# Altium schematic sheet HDMI_DP.SchDoc
size A4; SheetNumber: 7; SheetTotal: 10
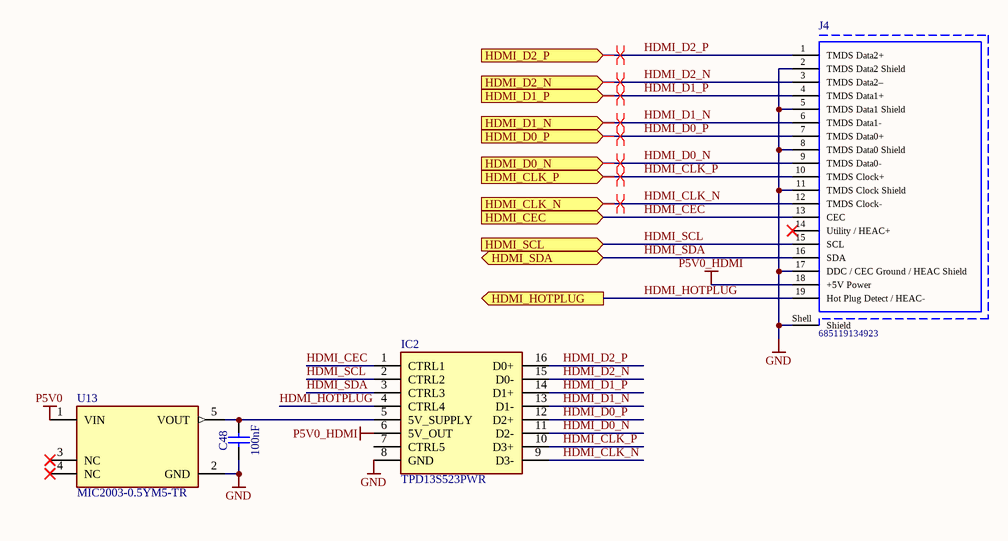
[diagram p0: HDMI_DP.SchDoc]

## Parts
C48  100nF  [CAPC1005X55N]
IC2  TPD13S523PWR  [SOP65P640X120-16N]
J4  685119134923  [685119134923]
U13  MIC2003-0.5YM5-TR  [FP-SOT23-5LD-PL-1-IPC_A]

## Ports
HDMI_CEC (in), HDMI_CLK_N (in), HDMI_CLK_P (in), HDMI_D0_N (in), HDMI_D0_P (in), HDMI_D1_N (in), HDMI_D1_P (in), HDMI_D2_N (in), HDMI_D2_P (in), HDMI_HOTPLUG (out), HDMI_SCL (in), HDMI_SDA (bidir)

## Nets
GND: C48.1 IC2.8(GND) J4.2(TMDS_Data2_Shield) J4.5(TMDS_Data1_Shield) J4.8(TMDS_Data0_Shield) J4.11(TMDS_Clock_Shield) J4.17(DDC_/_CEC_Ground_/_HEAC_Shield) J4.Shell(Shield) U13.2(GND)
P5V0: U13.1(VIN)
P5V0_HDMI: IC2.6(5V_OUT) J4.18(+5V_Power)
HDMI_CEC: IC2.1(CTRL1) J4.13(CEC) ; port HDMI_CEC
HDMI_CLK_N: IC2.9(D3-) J4.12(TMDS_Clock-) ; port HDMI_CLK_N
HDMI_CLK_P: IC2.10(D3+) J4.10(TMDS_Clock+) ; port HDMI_CLK_P
HDMI_D0_N: IC2.11(D2-) J4.9(TMDS_Data0-) ; port HDMI_D0_N
HDMI_D0_P: IC2.12(D2+) J4.7(TMDS_Data0+) ; port HDMI_D0_P
HDMI_D1_N: IC2.13(D1-) J4.6(TMDS_Data1-) ; port HDMI_D1_N
HDMI_D1_P: IC2.14(D1+) J4.4(TMDS_Data1+) ; port HDMI_D1_P
HDMI_D2_N: IC2.15(D0-) J4.3(TMDS_Data2–) ; port HDMI_D2_N
HDMI_D2_P: IC2.16(D0+) J4.1(TMDS_Data2+) ; port HDMI_D2_P
HDMI_HOTPLUG: IC2.4(CTRL4) J4.19(Hot_Plug_Detect_/_HEAC-) ; port HDMI_HOTPLUG
HDMI_SCL: IC2.2(CTRL2) J4.15(SCL) ; port HDMI_SCL
HDMI_SDA: IC2.3(CTRL3) J4.16(SDA) ; port HDMI_SDA
NetC48_2: C48.2 IC2.5(5V_SUPPLY) U13.5(VOUT)

Not connected (* = marked no-connect by the designer): IC2 7(CTRL5); J4 14(Utility_/_HEAC+)*; U13 3(NC)* 4(NC)*

## Layout directives
differential pair: HDMI_CLK_N, HDMI_CLK_P, HDMI_D0_N, HDMI_D0_P, HDMI_D1_N, HDMI_D1_P, HDMI_D2_N, HDMI_D2_P

## Library data of the parts
C48 = CC0402_100NF_16V_10%_X5R: Non-polarised capacitor; Manufacturer: GENERIC; Part Description: SMD Multilayer Chip Ceramic Capacitor; Manufacturer1 Part Number: GRM155R61C104KA88D; Tolerance: ±10%; Voltage: 16V; TC: X5R; Manufacturer Part Number: CC0402_100NF_16V_10%_X5R; Part Number: CC0402_100NF_16V_10%_X5R; Value: 100nF; Component Kind: Standard; Component Type: Standard; Pin Count: 2; Status: None; Case: 0402; Mounted: Yes; Socket: No; SMD: Yes; Sense: No; Manufacturer1 Example: MURATA; Manufacturer1 ComponentHeight: 0.55mm; HelpURL: \\cern.ch\dfs\Applications\Altium\Datasheets\CC0402_X5R_MURATA_GRM.pdf; Author: CERN DEM JLC; CreateDate: 10.12.2013; LatestRevisionDate: 10.12.2013
IC2 = TPD13S523PWR: Integrated Circuit; Manufacturer_Name: Texas Instruments; Datasheet Link: http://www.ti.com/lit/gpn/tpd13s523; Height: 1.2mm; Manufacturer_Part_Number: TPD13S523PWR
J4 = CMP-1502-00169-1: HDMI Type A Receptacle WR-HDMI, Horizontal, SMT; Manufacturer: Wurth Elektronik; Contact Resistance: 30mOhm; Working Voltage: 40VDC; Rated Current: 0.5A; Publisher: WurthElektronik; Datasheet URL: https://katalog.we-online.de/em/datasheet/685119134923.pdf; Gender: Receptacle; Manufacturer URL: http://www.we-online.de; Orientation: Horizontal; Mounting Technology: SMT; Part Number: 685119134923; Packaging: TapeandReel; Package Reference: 685119134923; Operating Temperature: -20to85degC; Connector Type: HDMITypeA
U13 = CMP-06320-000017-1: IC PWR SWITCH P-CHAN 1:1 SOT23-5; Max Input Voltage: 5.5V; Output Configuration: High Side; Min Input Voltage: 2.5V; On-State Resistance: 70mR; Number of Outputs: 1; Rated Current-Max: 500mA; Fault Protection: Over Temperature; Interface: On/Off; Output Voltage: 6V; On-state Resistance-Max: 100MR; Length: 2.9mm; Width: 1.6mm; Packaging: Tape and Reel; Series: -; Number of Pins: 5; Height: 1.1mm; Max Output Current: 500mA; Lead Free: Lead Free; Max Operating Temperature: 85°C; Min Operating Temperature: -40°C; Package Quantity: 3000; Number of Switches: 1; Mount: Surface Mount; Number of Inputs: 1; Current Rating: 500mA; Case/Package: SOT-23; REACH SVHC: No SVHC; RoHS Compliant: Yes